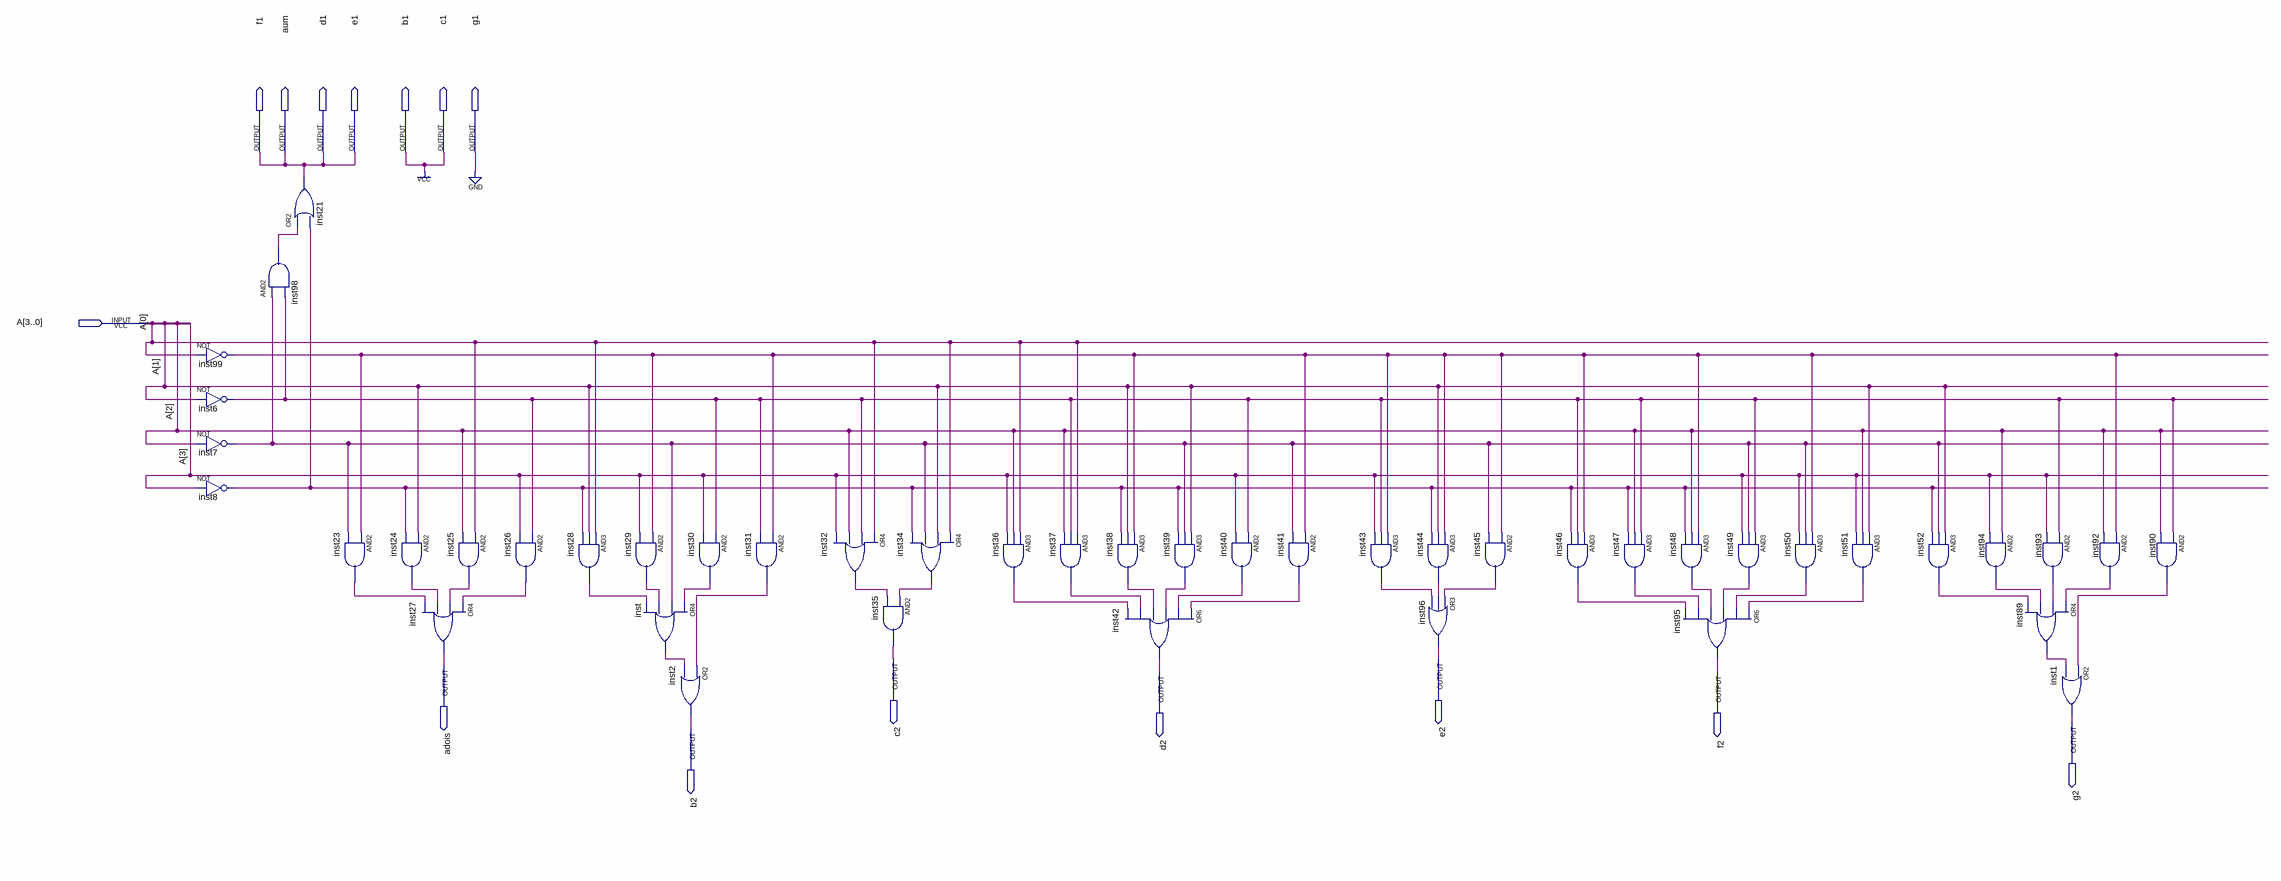
[diagram p0: schematic sheet]
// Quartus schematic 7segmentos_entrada.bdf as structural Verilog: 45 symbols, 15 pins
module \7segmentos_entrada  (
  input  [3:0] A,
  output f1,
  output aum,
  output d1,
  output e1,
  output b1,
  output c1,
  output g1,
  output c2,
  output e2,
  output adois,
  output d2,
  output f2,
  output g2,
  output b2
);

  wire inst6_out, inst7_out, inst8_out, inst23_out, inst24_out, inst25_out, inst26_out, inst28_out,
       inst29_out, inst30_out, inst31_out, inst32_out, inst34_out, inst36_out, inst37_out, inst38_out,
       inst39_out, inst40_out, inst41_out, inst43_out, inst44_out, inst45_out, inst46_out, inst47_out,
       inst48_out, inst49_out, inst50_out, inst51_out, inst52_out, inst89_out, inst90_out, inst92_out,
       inst93_out, inst94_out, inst98_out, inst99_out, inst_out;

  not inst99 (inst99_out, A[0]);
  not inst6 (inst6_out, A[1]);
  not inst7 (inst7_out, A[2]);
  not inst8 (inst8_out, A[3]);
  or inst21 (aum, inst98_out, inst8_out);
  and inst98 (inst98_out, inst7_out, inst6_out);
  and inst23 (inst23_out, inst99_out, inst7_out);
  and inst24 (inst24_out, A[1], inst8_out);
  or inst27 (adois, inst26_out, inst25_out, inst24_out, inst23_out);
  and inst25 (inst25_out, A[0], A[2]);
  and inst26 (inst26_out, inst6_out, A[3]);
  and inst28 (inst28_out, A[0], A[1], inst8_out);
  and inst29 (inst29_out, inst99_out, A[3]);
  or inst (inst_out, inst30_out, inst7_out, inst29_out, inst28_out);
  and inst30 (inst30_out, inst6_out, A[3]);
  or inst2 (b2, inst31_out, inst_out);
  and inst31 (inst31_out, inst99_out, inst6_out);
  or inst32 (inst32_out, A[0], inst6_out, A[2], A[3]);
  and inst35 (c2, inst34_out, inst32_out);
  or inst34 (inst34_out, A[0], A[1], inst7_out, inst8_out);
  and inst36 (inst36_out, A[0], A[2], A[3]);
  and inst37 (inst37_out, A[0], inst6_out, A[2]);
  and inst38 (inst38_out, inst99_out, A[1], inst8_out);
  or inst42 (d2, inst41_out, inst40_out, inst39_out, inst38_out, inst37_out, inst36_out);
  and inst39 (inst39_out, A[1], inst7_out, inst8_out);
  and inst40 (inst40_out, inst6_out, A[3]);
  and inst41 (inst41_out, inst99_out, inst7_out);
  and inst43 (inst43_out, inst99_out, inst6_out, A[3]);
  and inst44 (inst44_out, inst99_out, A[1], inst8_out);
  or inst96 (e2, inst45_out, inst44_out, inst43_out);
  and inst45 (inst45_out, inst99_out, inst7_out);
  and inst46 (inst46_out, inst99_out, inst6_out, inst8_out);
  and inst47 (inst47_out, inst6_out, A[2], inst8_out);
  and inst48 (inst48_out, inst99_out, A[2], inst8_out);
  or inst95 (f2, inst51_out, inst50_out, inst49_out, inst48_out, inst47_out, inst46_out);
  and inst49 (inst49_out, inst6_out, inst7_out, A[3]);
  and inst50 (inst50_out, inst99_out, inst7_out, A[3]);
  and inst51 (inst51_out, A[1], A[2], A[3]);
  and inst52 (inst52_out, A[1], inst7_out, inst8_out);
  and inst94 (inst94_out, A[2], A[3]);
  and inst93 (inst93_out, inst6_out, A[3]);
  or inst89 (inst89_out, inst92_out, inst93_out, inst94_out, inst52_out);
  or inst1 (g2, inst90_out, inst89_out);
  and inst92 (inst92_out, inst99_out, A[2]);
  and inst90 (inst90_out, inst6_out, A[2]);

  assign b1 = 1'b1;
  assign c1 = 1'b1;
  assign d1 = aum;
  assign e1 = aum;
  assign f1 = aum;
  assign g1 = 1'b0;
endmodule
